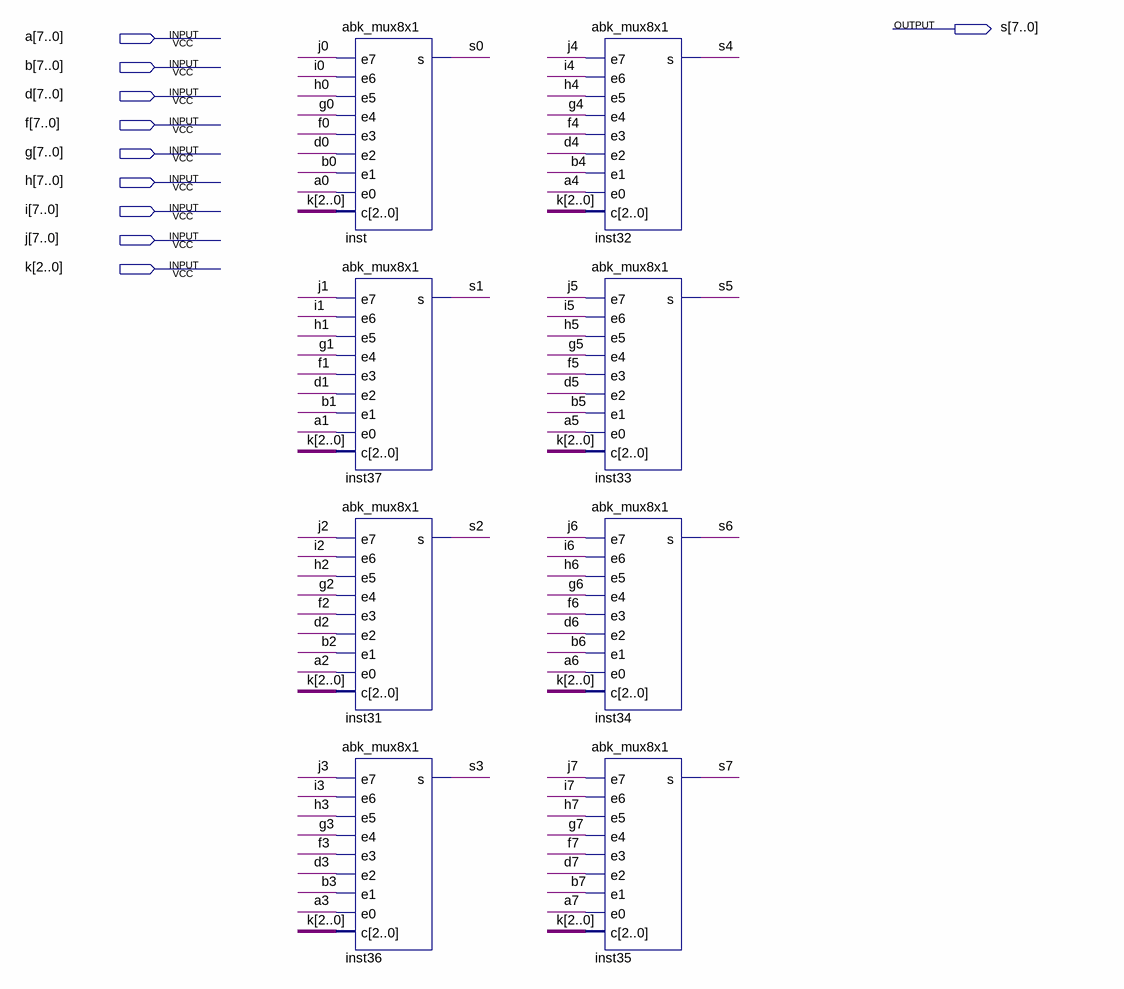
[diagram p0: schematic sheet]
// Quartus schematic abk_mux8x1_8.bdf as structural Verilog: 8 symbols, 10 pins
module abk_mux8x1_8 (
  input  [7:0] a,
  input  [7:0] b,
  input  [7:0] d,
  input  [7:0] f,
  input  [7:0] g,
  input  [7:0] h,
  input  [7:0] i,
  input  [7:0] j,
  input  [2:0] k,
  output [7:0] s
);

  abk_mux8x1 inst (
    .e7(j[0]), .e6(i[0]), .e5(h[0]), .e4(g[0]), .e3(f[0]), .e2(d[0]), .e1(b[0]), .e0(a[0]), .c(k), .s(s[0]));
  abk_mux8x1 inst37 (
    .e7(j[1]), .e6(i[1]), .e5(h[1]), .e4(g[1]), .e3(f[1]), .e2(d[1]), .e1(b[1]), .e0(a[1]), .c(k), .s(s[1]));
  abk_mux8x1 inst31 (
    .e7(j[2]), .e6(i[2]), .e5(h[2]), .e4(g[2]), .e3(f[2]), .e2(d[2]), .e1(b[2]), .e0(a[2]), .c(k), .s(s[2]));
  abk_mux8x1 inst36 (
    .e7(j[3]), .e6(i[3]), .e5(h[3]), .e4(g[3]), .e3(f[3]), .e2(d[3]), .e1(b[3]), .e0(a[3]), .c(k), .s(s[3]));
  abk_mux8x1 inst32 (
    .e7(j[4]), .e6(i[4]), .e5(h[4]), .e4(g[4]), .e3(f[4]), .e2(d[4]), .e1(b[4]), .e0(a[4]), .c(k), .s(s[4]));
  abk_mux8x1 inst33 (
    .e7(j[5]), .e6(i[5]), .e5(h[5]), .e4(g[5]), .e3(f[5]), .e2(d[5]), .e1(b[5]), .e0(a[5]), .c(k), .s(s[5]));
  abk_mux8x1 inst34 (
    .e7(j[6]), .e6(i[6]), .e5(h[6]), .e4(g[6]), .e3(f[6]), .e2(d[6]), .e1(b[6]), .e0(a[6]), .c(k), .s(s[6]));
  abk_mux8x1 inst35 (
    .e7(j[7]), .e6(i[7]), .e5(h[7]), .e4(g[7]), .e3(f[7]), .e2(d[7]), .e1(b[7]), .e0(a[7]), .c(k), .s(s[7]));
endmodule
